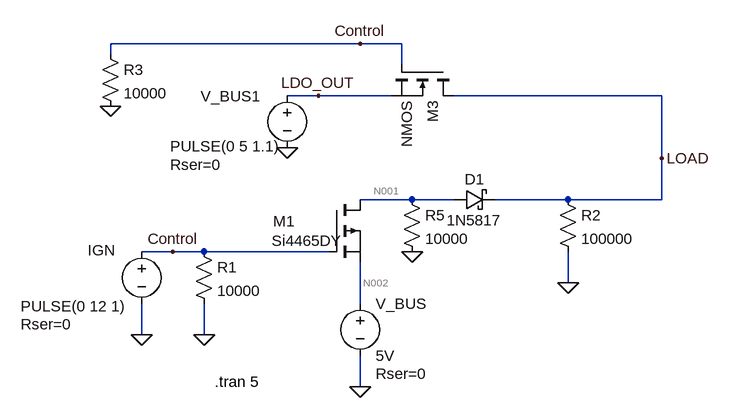
[diagram p0: schematic Power Input Selector.asc]
Power Input Selector.asc, the LTspice schematic file:
Version 4
SHEET 1 880 680
WIRE 240 -112 -144 -112
WIRE 304 -112 240 -112
WIRE -144 -96 -144 -112
WIRE 304 -80 304 -112
WIRE 176 -32 128 -32
WIRE 288 -32 176 -32
WIRE 704 -32 384 -32
WIRE 704 64 704 -32
WIRE 320 128 240 128
WIRE 384 128 320 128
WIRE 560 128 448 128
WIRE 704 128 704 64
WIRE 704 128 560 128
WIRE -48 208 -96 208
WIRE 0 208 -48 208
WIRE 192 208 0 208
WIRE 560 256 560 208
WIRE 240 288 240 224
WIRE -96 336 -96 288
WIRE 0 336 0 288
WIRE 240 416 240 368
FLAG 240 416 0
FLAG -96 336 0
FLAG 0 336 0
FLAG 560 256 0
FLAG 128 48 0
FLAG -48 208 Control
FLAG 176 -32 LDO_OUT
FLAG 704 64 LOAD
FLAG 240 -112 Control
FLAG -144 -16 0
FLAG 320 208 0
SYMBOL voltage -96 192 R0
WINDOW 0 -83 14 Left 2
WINDOW 3 -186 100 Left 2
WINDOW 123 0 0 Left 2
WINDOW 39 -186 128 Left 2
SYMATTR InstName IGN
SYMATTR Value PULSE(0 12 1)
SYMATTR SpiceLine Rser=0
SYMBOL voltage 240 272 R0
WINDOW 123 0 0 Left 2
WINDOW 39 24 124 Left 2
SYMATTR SpiceLine Rser=0
SYMATTR InstName V_BUS
SYMATTR Value 5V
SYMBOL res -16 192 R0
SYMATTR InstName R1
SYMATTR Value 10000
SYMBOL res 544 112 R0
SYMATTR InstName R2
SYMATTR Value 100000
SYMBOL pmos 192 128 R0
WINDOW 0 -86 33 Left 2
WINDOW 3 -88 63 Left 2
SYMATTR InstName M1
SYMATTR Value Si4465DY
SYMBOL voltage 128 -48 R0
WINDOW 0 -133 17 Left 2
WINDOW 3 -180 94 Left 2
WINDOW 123 0 0 Left 2
WINDOW 39 -180 122 Left 2
SYMATTR InstName V_BUS1
SYMATTR Value PULSE(0 5 1.1)
SYMATTR SpiceLine Rser=0
SYMBOL schottky 384 144 R270
WINDOW 0 32 32 VTop 2
WINDOW 3 0 32 VBottom 2
SYMATTR InstName D1
SYMATTR Value 1N5817
SYMATTR Description Diode
SYMATTR Type diode
SYMBOL res -160 -112 R0
SYMATTR InstName R3
SYMATTR Value 10000
SYMBOL nmos 384 -80 R90
SYMATTR InstName M3
SYMBOL res 304 112 R0
SYMATTR InstName R5
SYMATTR Value 10000
TEXT 16 408 Left 2 !.tran 5

The netlist it stands for:
* Power Input Selector.asc
V§IGN Control 0 PULSE(0 12 1) Rser=0
V_BUS N002 0 5V Rser=0
R1 Control 0 10000
R2 LOAD 0 100000
M1 N001 Control N002 N002 Si4465DY
V_BUS1 LDO_OUT 0 PULSE(0 5 1.1) Rser=0
D1 N001 LOAD 1N5817
R3 Control 0 10000
M3 LOAD Control LDO_OUT LDO_OUT NMOS
R5 N001 0 10000
.model D D
.lib standard.dio
.model NMOS NMOS
.model PMOS PMOS
.lib standard.mos
.tran 5
.backanno
.end

* Results of the author's LTspice run, read from the files saved beside the schematic
* Operating Point, zero values left out:
*   V(n002) = 5 V
*   V(load) = 4.967 V
*   V(n001) = 5 V
*   Id(M3) = 9.943 pA
*   Ib(M3) = -4.977 pA
*   Is(M3) = -4.967 pA
*   Id(M1) = -549.7 µA
*   Is(M1) = 549.7 µA
*   I(D1) = 49.67 µA
*   I(R5) = 500 µA
*   I(R2) = 49.67 µA
*   I(V_bus1) = 9.943 pA
*   I(V_bus) = -549.7 µA
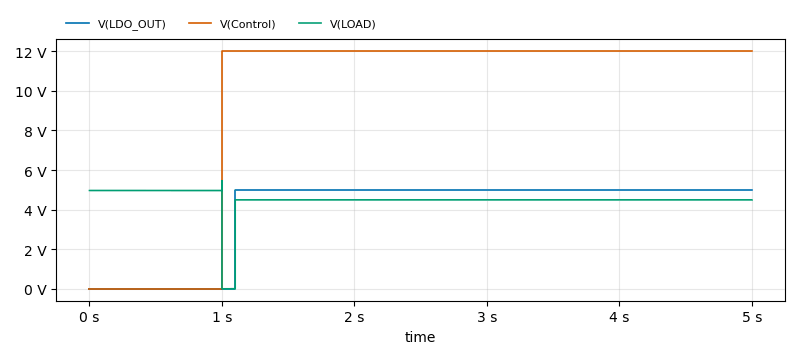
[diagram p1: Transient Analysis of Power Input Selector.asc, plotted from the saved traces]
* Transient Analysis, 1 run:
*   V(LDO_OUT): min 0 V, max 5 V, average 3.9 V, rms 4.416 V, last 5 V
*   V(Control): min 0 V, max 12 V, average 9.6 V, rms 10.73 V, last 12 V
*   V(LOAD): min 0 V, max 5.47 V, average 4.498 V, rms 4.548 V, last 4.494 V